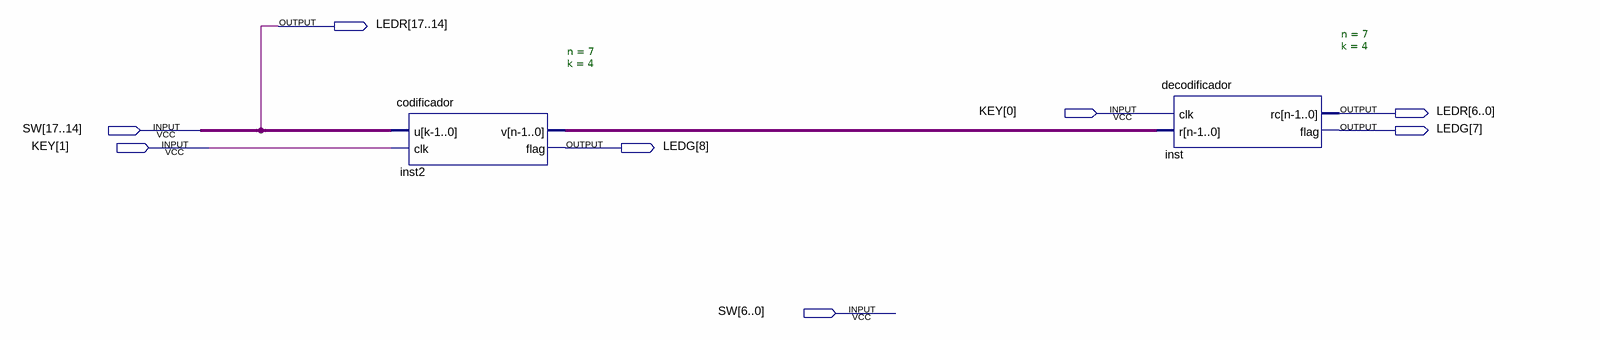
[diagram p0: schematic sheet]
// Quartus schematic erro.bdf as structural Verilog: 2 symbols, 8 pins
module erro (
  input  [1:0] KEY,
  input  [17:0] SW,
  output [17:0] LEDR,
  output [8:7] LEDG
);

  wire [6:0] inst2_v;

  codificador #(.n(7), .k(4)) inst2 (.u(SW[17:14]), .clk(KEY[1]), .v(inst2_v), .flag(LEDG[8]));
  decodificador #(.n(7), .k(4)) inst (.clk(KEY[0]), .r(inst2_v), .rc(LEDR[6:0]), .flag(LEDG[7]));
endmodule
